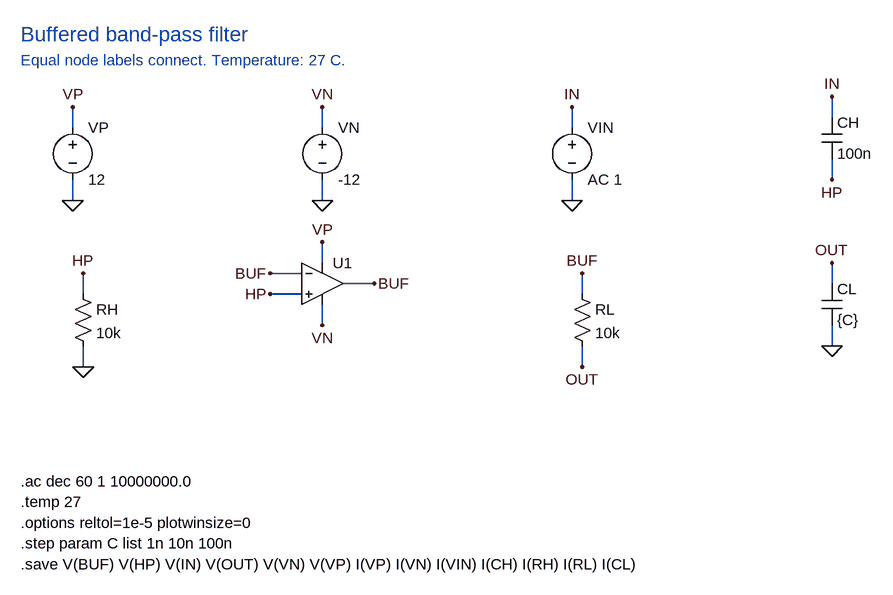
[diagram p0: schematic active-bandpass.asc]
active-bandpass.asc, the LTspice schematic file:
Version 4
SHEET 1 1740 1000
WIRE 144 176 144 144
WIRE 144 256 144 288
WIRE 528 176 528 144
WIRE 528 256 528 288
WIRE 912 176 912 144
WIRE 912 256 912 288
WIRE 1312 160 1312 128
WIRE 1312 224 1312 256
WIRE 160 432 160 400
WIRE 160 512 160 544
WIRE 496 432 448 432
WIRE 496 400 448 400
WIRE 528 384 528 352
WIRE 528 448 528 480
WIRE 560 416 608 416
WIRE 928 432 928 400
WIRE 928 512 928 544
WIRE 1312 416 1312 384
WIRE 1312 480 1312 512
FLAG 144 144 VP
FLAG 144 288 0
FLAG 528 144 VN
FLAG 528 288 0
FLAG 912 144 IN
FLAG 912 288 0
FLAG 1312 128 IN
FLAG 1312 256 HP
FLAG 160 400 HP
FLAG 160 544 0
FLAG 448 432 HP
FLAG 448 400 BUF
FLAG 528 352 VP
FLAG 528 480 VN
FLAG 608 416 BUF
FLAG 928 400 BUF
FLAG 928 544 OUT
FLAG 1312 384 OUT
FLAG 1312 512 0
SYMBOL voltage 144 160 R0
SYMATTR InstName VP
SYMATTR Value 12
SYMBOL voltage 528 160 R0
SYMATTR InstName VN
SYMATTR Value -12
SYMBOL voltage 912 160 R0
SYMATTR InstName VIN
SYMATTR Value AC 1
SYMBOL cap 1296 160 R0
SYMATTR InstName CH
SYMATTR Value 100n
SYMBOL res 144 416 R0
SYMATTR InstName RH
SYMATTR Value 10k
SYMBOL OpAmps/UniversalOpamp2 528 416 R0
SYMATTR InstName U1
SYMATTR SpiceModel level2
SYMATTR Value2 Avol=1Meg GBW=10Meg Slew=10Meg
SYMATTR SpiceLine Ilimit=100m Rail=0.5 Vos=0
SYMATTR SpiceLine2 En=0 Enk=0 In=0 Ink=0 Rin=1G
SYMBOL res 912 416 R0
SYMATTR InstName RL
SYMATTR Value 10k
SYMBOL cap 1296 416 R0
SYMATTR InstName CL
SYMATTR Value {C}
TEXT 64 32 Left 3 ;Buffered band-pass filter
TEXT 64 72 Left 2 ;Equal node labels connect. Temperature: 27 C.
TEXT 64 720 Left 2 !.ac dec 60 1 10000000.0
TEXT 64 752 Left 2 !.temp 27
TEXT 64 784 Left 2 !.options reltol=1e-5 plotwinsize=0
TEXT 64 816 Left 2 !.step param C list 1n 10n 100n
TEXT 64 848 Left 2 !.save V(BUF) V(HP) V(IN) V(OUT) V(VN) V(VP) I(VP) I(VN) I(VIN) I(CH) I(RH) I(RL) I(CL)

The netlist it stands for:
* active-bandpass.asc
VP VP 0 12
VN VN 0 -12
VIN IN 0 AC 1
CH IN HP 100n
RH HP 0 10k
XU1 HP BUF VP VN BUF level2 Avol=1Meg GBW=10Meg Slew=10Meg Ilimit=100m Rail=0.5 Vos=0 En=0 Enk=0 In=0 Ink=0 Rin=1G  ; pins In+ In- V+ V- OUT
RL BUF OUT 10k
CL OUT 0 {C}
* Buffered band-pass filter
* Equal node labels connect. Temperature: 27 C.
.ac dec 60 1 10000000.0
.temp 27
.options reltol=1e-5 plotwinsize=0
.step param C list 1n 10n 100n
.save V(BUF) V(HP) V(IN) V(OUT) V(VN) V(VP) I(VP) I(VN) I(VIN) I(CH) I(RH) I(RL) I(CL)
.lib UniversalOpAmp2.lib
.backanno
.end